# EAGLE design mast_panel_board (EAGLE 9.5.0)
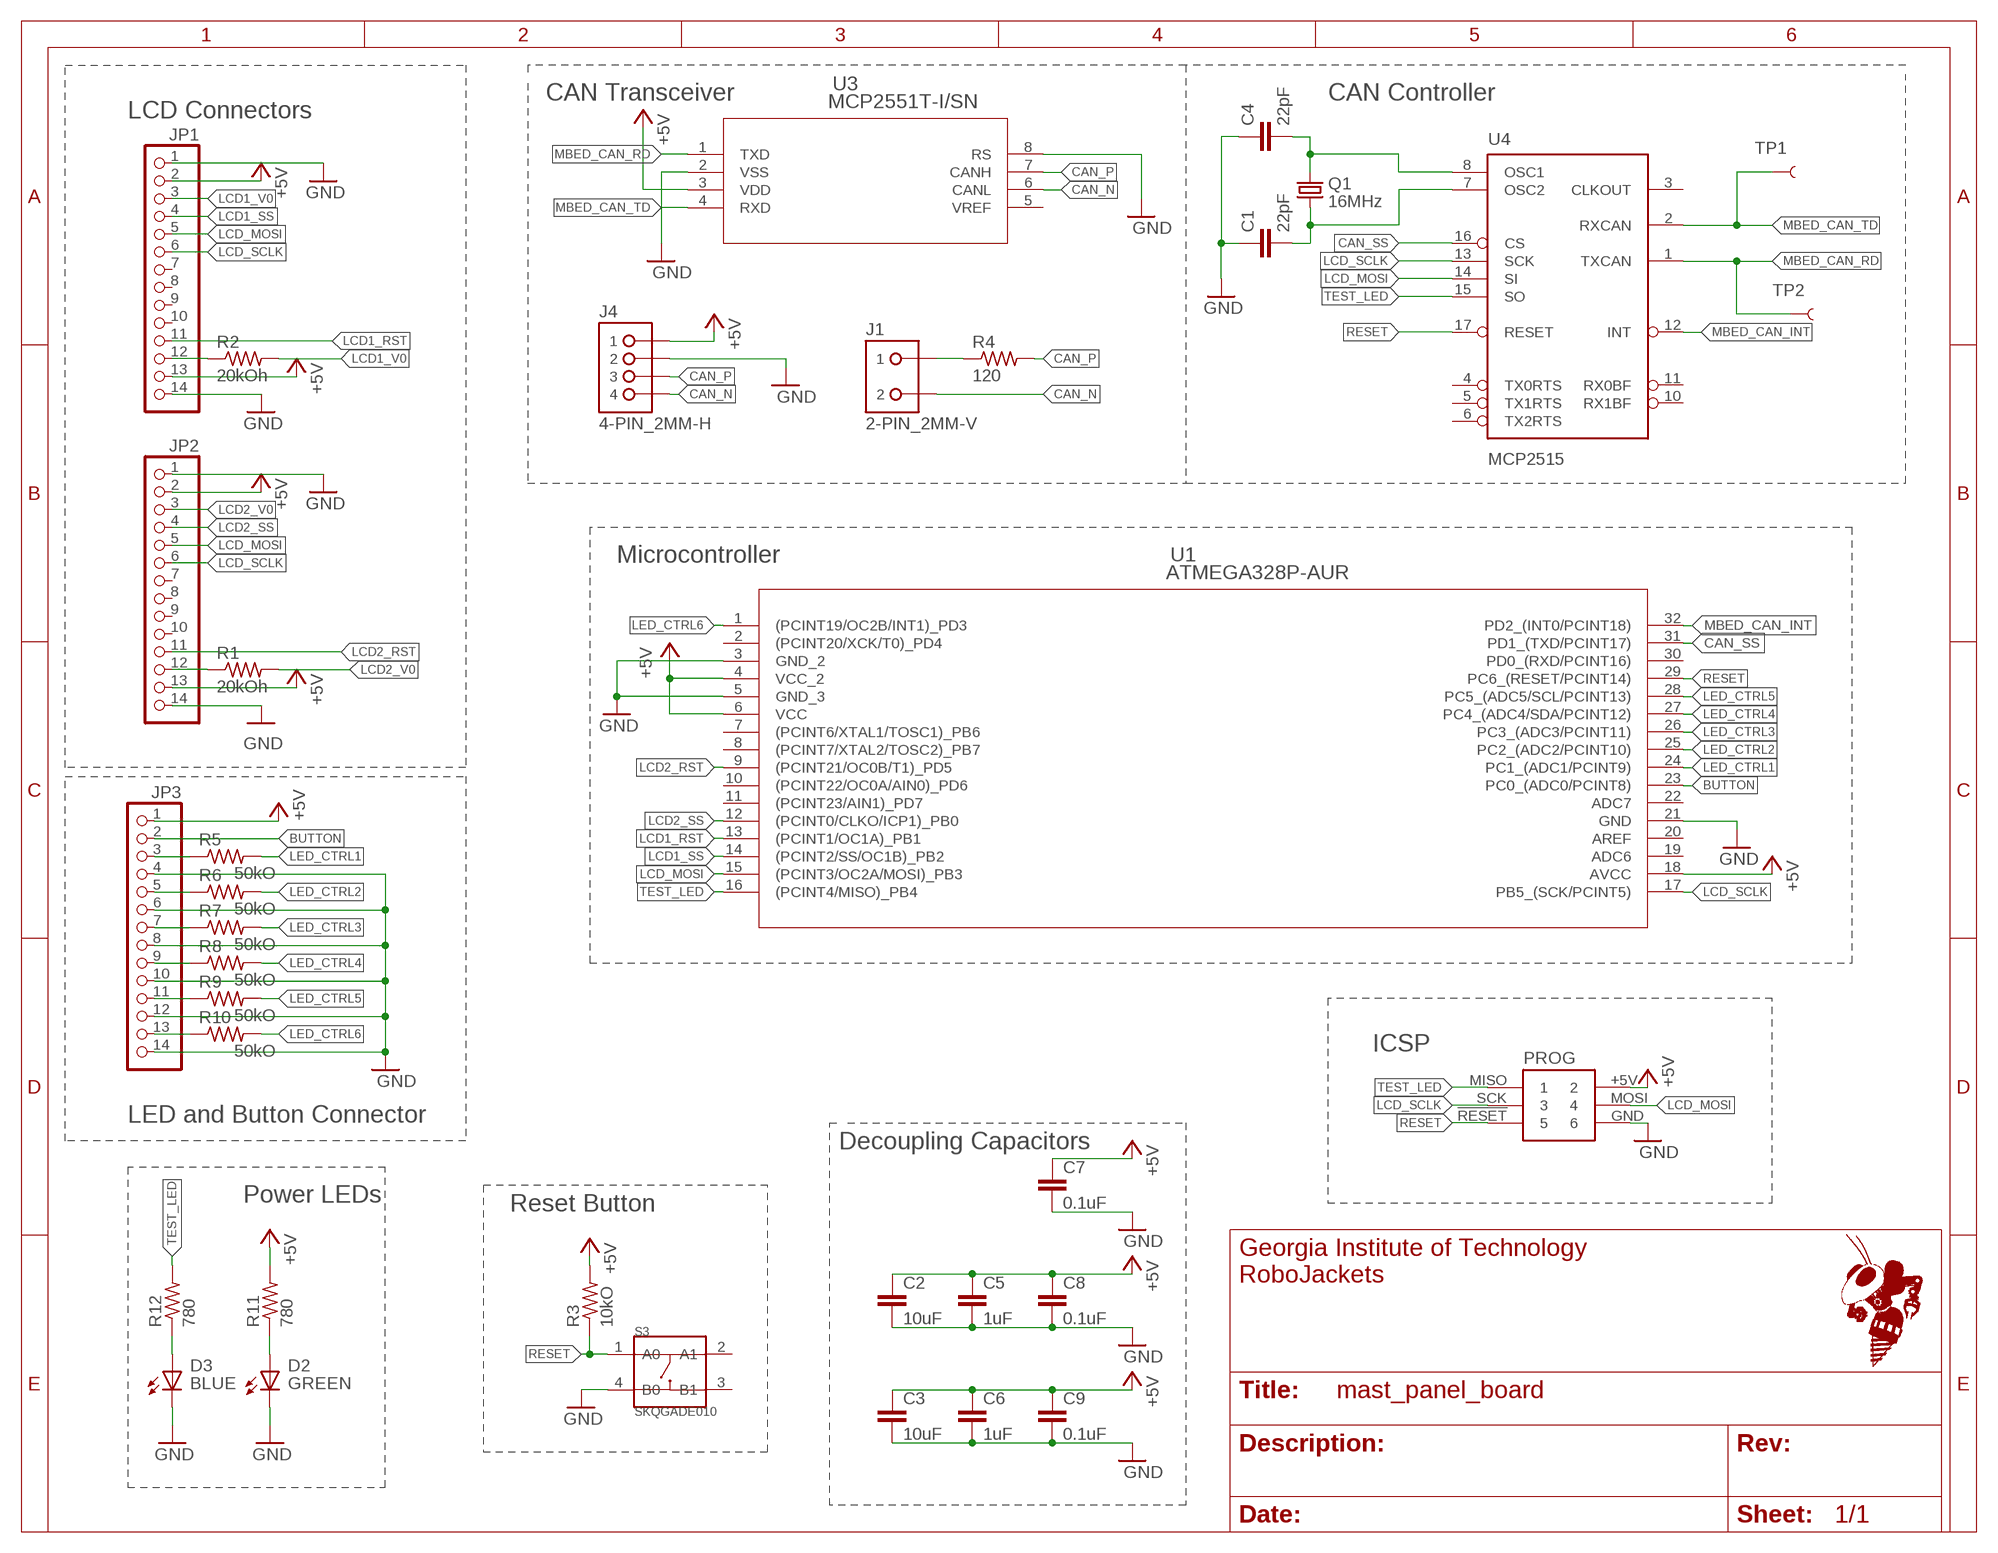
[diagram p0: schematic, sheet 1]

## Parts
C1  22pF  22PF-50V-5%(0603)  [0603-CAP]
C2  10uF  C-EUC0805  [C0805]
C3  10uF  C-EUC0805  [C0805]
C4  22pF  22PF-50V-5%(0603)  [0603-CAP]
C5  1uF  C-EUC0603  [C0603]
C6  1uF  C-EUC0603  [C0603]
C7  0.1uF  C-EUC0402  [C0402]
C8  0.1uF  C-EUC0402  [C0402]
C9  0.1uF  C-EUC0402  [C0402]
D2  GREEN  LED-SMD-GREEN  [CHIP-LED0603]
D3  BLUE  LED-SMD-BLUE  [CHIP-LED0603]
J1  2-PIN_2MM-V  [2MM-2-V]
J4  4-PIN_2MM-H  [2MM-4-H]
JP1  PINHD-1X14  [1X14]
JP2  PINHD-1X14  [1X14]
JP3  PINHD-1X14  [1X14]
PROG  ICSP Connector  2X3SHROUDED  [2X3SHROUDED]
Q1  16MHz  CRYSTAL5X3  [CRYSTAL-SMD-5X3]
R1  20kOh  R-US_R0603  [R0603]
R2  20kOh  R-US_R0603  [R0603]
R3  10kO  R-US_R0603  [R0603]
R4  120  R-US_R0603  [R0603]
R5  50kO  R-US_R0805  [R0805]
R6  50kO  R-US_R0805  [R0805]
R7  50kO  R-US_R0805  [R0805]
R8  50kO  R-US_R0805  [R0805]
R9  50kO  R-US_R0805  [R0805]
R10  50kO  R-US_R0805  [R0805]
R11  780  R-US_R0402  [R0402]
R12  780  R-US_R0402  [R0402]
S3  SKQGADE010  SMD-SWITCH-TOP-260GF(4P-D5.2MM)  [SW4-SMD-5.2X5.2X1.5MM]
TP1  TEST-POINT3X5  [PAD.03X.05]
TP2  TEST-POINT3X5  [PAD.03X.05]
U1  ATMEGA328P-AUR  [32A]
U3  MCP2551T-I/SN  [SOIC8-N_MC]
U4  MCP2515  MCP2510SO  [SO-18W]

## Nets
+5V: C2.1 C3.1 C5.1 C6.1 C7.1 C8.1 C9.1 J4.1 JP1.2 JP1.13 JP2.2 JP2.13 JP3.1 PROG.+5V R3.2 R11.2 U1.4(VCC_2) U1.6(VCC) U1.18(AVCC) U3.3(VDD)
BUTTON: JP3.2 U1.23(PC0_(ADC0/PCINT8))
CAN_N: J1.2 J4.4 U3.6(CANL)
CAN_P: J4.3 R4.2 U3.7(CANH)
CAN_SS: U1.31(PD1_(TXD/PCINT17)) U4.16(CS)
GND: C1.1 C2.2 C3.2 C4.1 C5.2 C6.2 C7.2 C8.2 C9.2 D2.C(K) D3.C(K) J4.2 JP1.1 JP1.14 JP2.1 JP2.14 JP3.4 JP3.6 JP3.8 JP3.10 JP3.12 JP3.14 PROG.GND S3.4(B0) U1.3(GND_2) U1.5(GND_3) U1.21(GND) U3.2(VSS) U3.8(RS)
LCD1_RST: JP1.11 U1.13((PCINT1/OC1A)_PB1)
LCD1_SS: JP1.4 U1.14((PCINT2/SS/OC1B)_PB2)
LCD1_V0: JP1.3 R2.2
LCD2_RST: JP2.11 U1.9((PCINT21/OC0B/T1)_PD5)
LCD2_SS: JP2.4 U1.12((PCINT0/CLKO/ICP1)_PB0)
LCD2_V0: JP2.3 R1.2
LCD_MOSI: JP1.5 JP2.5 PROG.MOSI U1.15((PCINT3/OC2A/MOSI)_PB3) U4.14(SI)
LCD_SCLK: JP1.6 JP2.6 PROG.SCK U1.17(PB5_(SCK/PCINT5)) U4.13(SCK)
LED1: JP3.3 R5.1
LED2: JP3.5 R6.1
LED3: JP3.7 R7.1
LED4: JP3.9 R8.1
LED5: JP3.11 R9.1
LED6: JP3.13 R10.1
LED_CTRL1: R5.2 U1.24(PC1_(ADC1/PCINT9))
LED_CTRL2: R6.2 U1.25(PC2_(ADC2/PCINT10))
LED_CTRL3: R7.2 U1.26(PC3_(ADC3/PCINT11))
LED_CTRL4: R8.2 U1.27(PC4_(ADC4/SDA/PCINT12))
LED_CTRL5: R9.2 U1.28(PC5_(ADC5/SCL/PCINT13))
LED_CTRL6: R10.2 U1.1((PCINT19/OC2B/INT1)_PD3)
MBED_CAN_INT: U1.32(PD2_(INT0/PCINT18)) U4.12(INT)
MBED_CAN_RD: TP2.P$1 U3.1(TXD) U4.1(TXCAN)
MBED_CAN_TD: TP1.P$1 U3.4(RXD) U4.2(RXCAN)
N$1: J1.1 R4.1
N$4: JP1.12 R2.1
N$6: D2.A R11.1
N$7: D3.A R12.1
N$9: JP2.12 R1.1
N$17: C4.2 Q1.3 U4.8(OSC1)
N$18: C1.2 Q1.1 U4.7(OSC2)
RESET: PROG.!RESET R3.1 S3.1(A0) U1.29(PC6_(RESET/PCINT14)) U4.17(RESET)
TEST_LED: PROG.MISO R12.2 U1.16((PCINT4/MISO)_PB4) U4.15(SO)
Unconnected: JP1.7 JP1.8 JP1.9 JP1.10 JP2.7 JP2.8 JP2.9 JP2.10 S3.2(A1) S3.3(B1) U1.2((PCINT20/XCK/T0)_PD4) U1.7((PCINT6/XTAL1/TOSC1)_PB6) U1.8((PCINT7/XTAL2/TOSC2)_PB7) U1.10((PCINT22/OC0A/AIN0)_PD6) U1.11((PCINT23/AIN1)_PD7) U1.19(ADC6) U1.20(AREF) U1.22(ADC7) U1.30(PD0_(RXD/PCINT16)) U3.5(VREF) U4.3(CLKOUT) U4.4(TX0RTS) U4.5(TX1RTS) U4.6(TX2RTS) U4.10(RX1BF) U4.11(RX0BF)

## Notes on the sheet
- CAN Transceiver | CAN Controller
- LCD Connectors
- Microcontroller
- ICSP
- LED and Button Connector
- Decoupling Capacitors
- Power LEDs
- Reset Button

## Power pins joined to a net without a drawn wire
VDD: U4.18(VDD)
VSS: U4.9(VSS)

## Library data of the parts
C1 C4 = SparkFun-Capacitors:22PF-50V-5%(0603): CAP-07876; PROD_ID: CAP-07876
C2 C3 C5-C9 = rcl:C-EU: CAPACITOR, European symbol; SPICEPREFIX: C
D2 = RoboJackets-LEDs:LED-SMD; DIGIKEY: 160-1446-1-ND; MPN: LTST-C191KGKT
D3 = RoboJackets-LEDs:LED-SMD; DIGIKEY: 160-1647-1-ND; MPN: LTST-C191TBKT
J1 = RoboJackets-Connectors:2-PIN_2MM-*; PINS: 2; PIN_PITCH: 2.0 mm
J4 = RoboJackets-Connectors:4-PIN_2MM-*: MPN: 0353630460; DIGIKEY: WM18933-ND; MPN: 0353630460
JP1-JP3 = pinhead:PINHD-1X14: PIN HEADER
PROG = lcd-buzzer:2X3SHROUDED
Q1 = SparkFun-FreqCtrl:CRYSTAL: Various standard crystals. Proven footprints.; PROD_ID: XTAL-08218
R1-R12 = rcl:R-US_: RESISTOR, American symbol; SPICEPREFIX: R
S3 = rgb-led:SMD-SWITCH-TOP-260GF(4P-D5.2MM): 311020017; MPN: SKQGADE010
TP1 TP2 = SparkFun-Passives:TEST-POINT: Bare copper test points for troubleshooting or ICT
U1 = MastPanel:ATMEGA328P-AUR: 32-Pin ATmega328P-AUR http://ww1.microchip.com/downloads/en/DeviceDoc/ATmega48A-PA-88A-PA-168A-PA-328-P-DS-DS40002061A.pdf; BUILT_BY: EMA_UL_Team; MANUFACTURER_PART_NUMBER: ATMEGA328P-AUR; VENDOR: Atmel
U3 = MCP2551T:MCP2551T-I/SN; MANUFACTURER_PART_NUMBER: MCP2551TISN; VENDOR: Microchip
U4 = SparkFun-DigitalIC:MCP2510: CAN controller with SPI interface to any MCU. Original design by Microchip.; PROD_ID: IC-09906

## Board
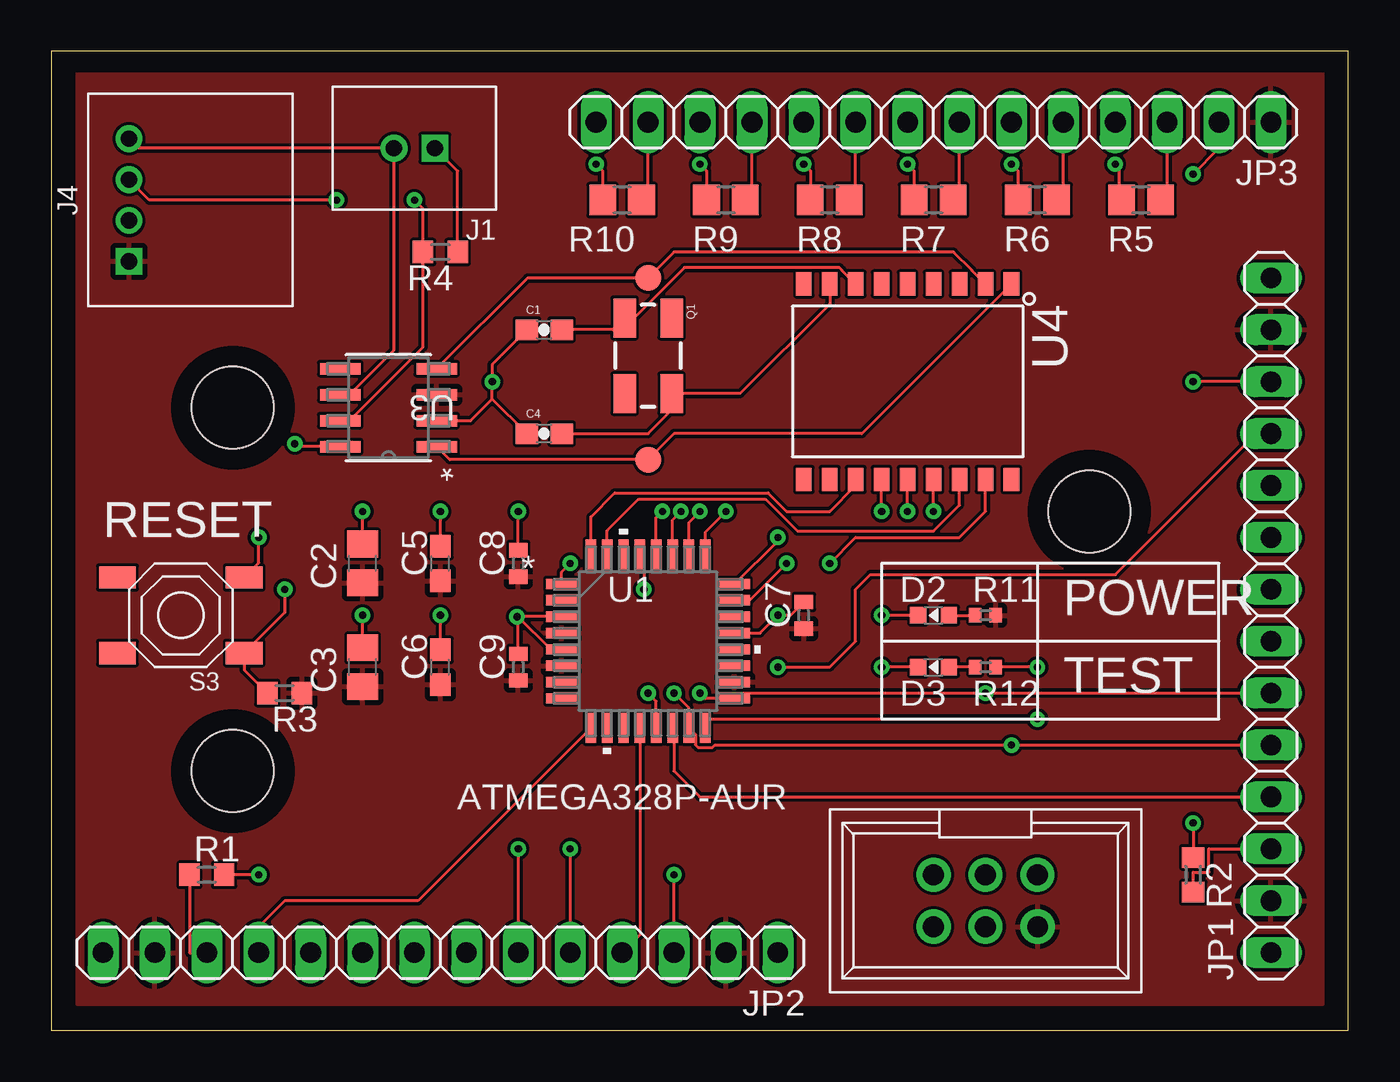
[diagram p1: board, top side]
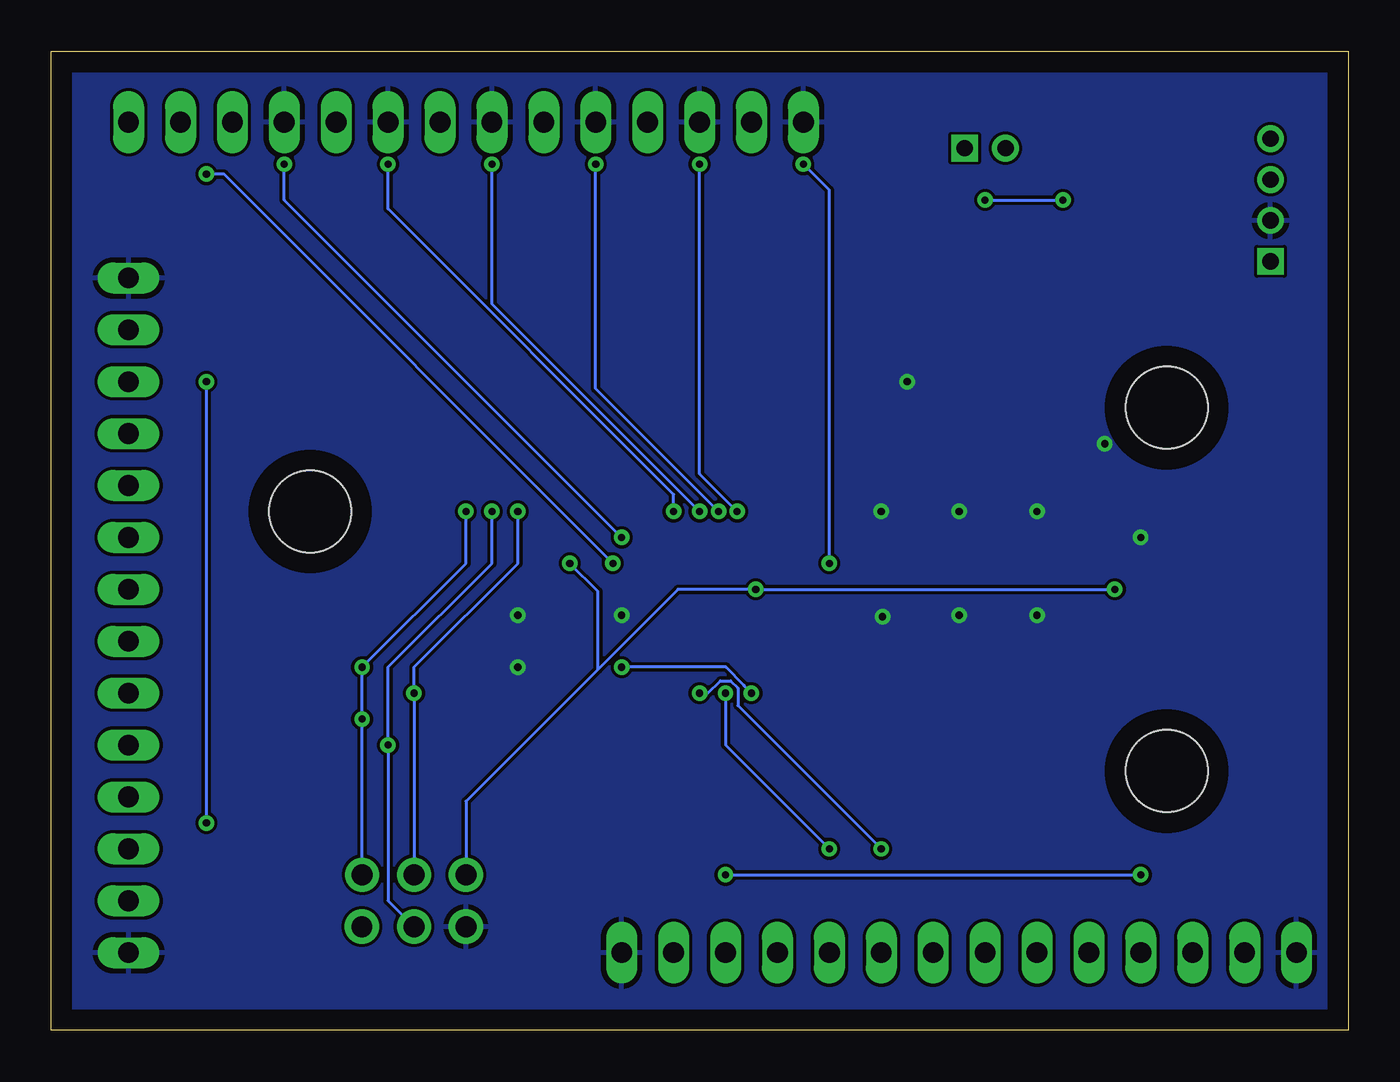
[diagram p2: board, bottom side, seen from below]

Size 63.48 x 47.93 mm. Coordinates in mm from the lower left corner, seen from the top.
Outline: 0,0 63.48,0 63.48,47.93 0,47.93 0,0
Copper layers (1*16): Top 0.035mm / dielectric 1.5mm / Bottom 0.035mm
Design rules "default": minimum track width 6mil, minimum drill 0.35mm, track to track 6mil, track to pad 6mil, pad to pad 6mil, via to via 6mil, smd to smd 6mil, copper to edge 40mil, drill to drill 6mil, minimum pad ring 10mil, minimum via ring 8mil, stop-mask expansion 4mil, vias tented up to drill 0mil, thermal gap 10mil
Holes 4 mm at 8.89,30.48 8.89,12.7 50.8,25.4

### Footprints (pad centres in the part's own frame; a part is rotated, then mirrored left to right if it is on the bottom)
0603-CAP = smd 1.1 x 1: 1 -0.85,0; 2 0.85,0
C0805 = smd 1.3 x 1.5: 1 -0.95,0; 2 0.95,0
C0603 = smd 1.1 x 1: 1 -0.85,0; 2 0.85,0
C0402 = smd 0.7 x 0.9: 1 -0.65,0; 2 0.65,0
CHIP-LED0603 = smd 0.8 x 0.8: A 0,-0.75; C 0,0.75
2MM-2-V = drill 0.8 square: 1 -1,0 | drill 0.8: 2 1,0
2MM-4-H = drill 0.8 square: 1 -3,0 | drill 0.8: 2 -1,0; 3 1,0; 4 3,0
1X14 = drill 1.016 long: 1 -16.51,0; 2 -13.97,0; 3 -11.43,0; 4 -8.89,0; 5 -6.35,0; 6 -3.81,0; 7 -1.27,0; 8 1.27,0; 9 3.81,0; 10 6.35,0; 11 8.89,0; 12 11.43,0; 13 13.97,0; 14 16.51,0
2X3SHROUDED = drill 1.02 pad 1.676: !RESET -2.54,1.27; +5V 2.554,-1.27; GND -2.54,-1.27; MISO 2.54,1.27; MOSI 0,-1.27; SCK 0,1.27
CRYSTAL-SMD-5X3 = smd 1.9 x 1.1: 1 -1.85,-1.15; 2 1.85,-1.15; 3 1.85,1.15; 4 -1.85,1.15
R0603 = smd 1 x 1.1: 1 -0.85,0; 2 0.85,0
R0805 = smd 1.3 x 1.5: 1 -0.95,0; 2 0.95,0
R0402 = smd 0.6 x 0.7: 1 -0.5,0; 2 0.5,0
SW4-SMD-5.2X5.2X1.5MM = smd 1.8 x 1.1: 1 -3.1,1.85; 2 3.1,1.85; 3 3.1,-1.85; 4 -3.1,-1.85
PAD.03X.05 = smd 1.27 x 1.27: P$1 0,0
32A = smd 1.473 x 0.508: 1 -4.242,2.8; 2 -4.242,2; 3 -4.242,1.2; 4 -4.242,0.4; 5 -4.242,-0.4; 6 -4.242,-1.2; 7 -4.242,-2; 8 -4.242,-2.8; 17 4.242,-2.8; 18 4.242,-2; 19 4.242,-1.2; 20 4.242,-0.4; 21 4.242,0.4; 22 4.242,1.2; 23 4.242,2; 24 4.242,2.8 | smd 0.508 x 1.473: 9 -2.8,-4.242; 10 -2,-4.242; 11 -1.2,-4.242; 12 -0.4,-4.242; 13 0.4,-4.242; 14 1.2,-4.242; 15 2,-4.242; 16 2.8,-4.242; 25 2.8,4.242; 26 2,4.242; 27 1.2,4.242; 28 0.4,4.242; 29 -0.4,4.242; 30 -1.2,4.242; 31 -2,4.242; 32 -2.8,4.242
SOIC8-N_MC = smd 1.981 x 0.559: 1 -2.362,1.905; 2 -2.362,0.635; 3 -2.362,-0.635; 4 -2.362,-1.905; 5 2.362,-1.905; 6 2.362,-0.635; 7 2.362,0.635; 8 2.362,1.905
SO-18W = smd 0.762 x 1.143: 1 -5.08,-4.788; 2 -3.81,-4.788; 3 -2.54,-4.788; 4 -1.27,-4.788; 5 0,-4.788; 6 1.27,-4.788; 7 2.54,-4.788; 8 3.81,-4.788; 9 5.08,-4.788; 10 5.08,4.788; 11 3.81,4.788; 12 2.54,4.788; 13 1.27,4.788; 14 0,4.788; 15 -1.27,4.788; 16 -2.54,4.788; 17 -3.81,4.788; 18 -5.08,4.788

### Placement (x,y rotation side)
C1  24.13,34.29 0 top
C2  15.24,22.86 90 top
C3  15.24,17.78 90 top
C4  24.13,29.21 0 top
C5  19.05,22.86 90 top
C6  19.05,17.78 90 top
C7  36.83,20.32 90 top
C8  22.86,22.86 90 top
C9  22.86,17.78 90 top
D2  43.18,20.32 90 top
D3  43.18,17.78 90 top
J1  17.78,43.18 180 top
J4  3.81,40.64 90 top
JP1  59.69,20.32 90 top
JP2  19.05,3.81 180 top
JP3  43.18,44.45 180 top
PROG  45.72,6.35 0 top
Q1  29.21,33.02 270 top
R1  7.62,7.62 0 top
R2  55.88,7.62 270 top
R3  11.43,16.51 0 top
R4  19.05,38.1 180 top
R5  53.34,40.64 180 top
R6  48.26,40.64 180 top
R7  43.18,40.64 180 top
R8  38.1,40.64 180 top
R9  33.02,40.64 180 top
R10  27.94,40.64 180 top
R11  45.72,20.32 0 top
R12  45.72,17.78 0 top
S3  6.35,20.32 180 top
TP1  29.21,36.83 0 top
TP2  29.21,27.94 0 top
U1  29.21,19.05 0 top
U3  16.51,30.48 180 top
U4  41.91,31.75 180 top

### Tracks (layer width: path | path; a pad name or v marks a point on that pad's centre or on a via)
+5V
  pour Top: 1.27,46.99 62.23,46.99 62.23,1.27 1.27,1.27
BUTTON  (via drill 0.35)
  Top 0.152: v55.88,41.91 57.15,43.18 JP3.2 | U1.23 34.18,21.05 v35.99,22.86
  Bottom 0.152: v35.99,22.86 36.22,23.09 36.22,23.11 55.02,41.91 v55.88,41.91
CAN_N
  Top 0.152: U3.6 14.61,31.12 16.78,33.29 J1.2 4.27,43.18 J4.4
CAN_P  (via drill 0.35)
  Top 0.152: v13.97,40.64 4.81,40.64 J4.3 | U3.7 14.61,29.84 18.2,33.44 R4.2 18.2,40.22 v17.78,40.64
  Bottom 0.152: v17.78,40.64 v13.97,40.64
CAN_SS
  Top 0.152: U4.16 44.45,25.7 43.18,24.44 36.52,24.44 34.95,26.01 28.75,26.01 27.21,24.47 U1.31
GND  (via drill 0.35)
  Top 0.152: C3.2 v15.24,20.32 | C2.2 v15.24,25.4 | C8.2 v22.86,25.4 | C6.2 v19.05,20.32 | C9.2 22.86,20.19 v22.79,20.25 v22.8,20.25 22.86,20.25 | U1.21 34.69,19.45 v35.56,20.32 36.18,20.32 C7.2 | D2.C v40.64,20.32 | D3.C v40.64,17.78 | S3.4 10.16,22.88 v10.16,24.13 | C1.1 21.59,32.6 v21.59,31.75 21.59,30.9 | U1.5 24.45,18.65 22.86,20.24 22.86,20.25 | U1.3 22.86,20.25 | C5.2 v19.05,25.4 | U3.8 12.06,28.58 v11.92,28.72 | C4.1 21.59,30.9 | U3.2 20.54,29.84 21.59,30.9
  pour Bottom: 0,46.99 63.5,46.99 63.5,0 0,0
LCD1_RST  (via drill 0.35)
  Top 0.152: U1.13 29.61,16.11 v29.21,16.51 | v35.56,17.78 38.1,17.78 39.37,19.05 39.37,21.59 40.09,22.31 52.08,22.31 58.98,29.21 JP1.11
  Bottom 0.152: v29.21,16.51 29.57,16.87 29.57,16.89 30.46,17.78 v35.56,17.78
LCD1_SS
  Top 0.152: U1.14 30.48,14.74 30.48,12.7 31.75,11.43 JP1.4
LCD1_V0
  Top 0.152: R2.2 55.88,7.74 56.66,7.74 56.66,8.89 JP1.3
LCD2_RST
  Top 0.152: U1.9 17.95,6.35 11.43,6.35 10.16,5.08 JP2.11
LCD2_SS
  Top 0.152: U1.12 28.81,4.68 JP2.4
LCD2_V0  (via drill 0.35)
  Top 0.152: JP2.3 v30.48,7.62 | v10.16,7.62 R1.2
  Bottom 0.152: v30.48,7.62 v10.16,7.62
LCD_MOSI  (via drill 0.35)
  Top 0.152: v30.48,16.51 31.21,15.78 U1.15 31.53,14.49 31.53,13.98 31.66,13.84 32.36,13.84 32.49,13.97 v46.99,13.97 JP1.5 | v25.4,8.89 JP2.5 | v41.91,25.4 U4.14
  Bottom 0.152: PROG.MOSI 46.99,6.35 v46.99,13.97 46.99,17.78 41.91,22.86 v41.91,25.4 | v30.48,16.51 30.48,13.97 v25.4,8.89
LCD_SCLK  (via drill 0.35)
  Top 0.152: v31.75,16.51 32.01,16.25 U1.17 33.71,16.51 v45.72,16.51 JP1.6 | v22.86,8.89 JP2.6 | v40.64,25.4 U4.13
  Bottom 0.152: v22.86,8.89 29.87,15.9 29.87,16.76 30.23,17.12 30.73,17.12 31.34,16.51 v31.75,16.51 | v40.64,25.4 40.64,22.86 45.72,17.78 v45.72,16.51 PROG.SCK
LED1
  Top 0.152: R5.1 54.61,40.96 JP3.3
LED2
  Top 0.152: R6.1 49.53,40.96 JP3.5
LED3
  Top 0.152: R7.1 44.45,40.96 JP3.7
LED4
  Top 0.152: R8.1 39.37,40.96 JP3.9
LED5
  Top 0.152: R9.1 34.29,40.96 JP3.11
LED6
  Top 0.152: R10.1 29.21,40.96 JP3.13
LED_CTRL1  (via drill 0.35)
  Top 0.152: R5.2 52.24,40.64 52.24,42.22 v52.07,42.4 | U1.24 35.56,23.96 v35.56,24.13
  Bottom 0.152: v35.56,24.13 52.07,40.64 v52.07,42.4
LED_CTRL2  (via drill 0.35)
  Top 0.152: U1.25 32.01,24.39 v33.02,25.4 | v46.99,42.4 47.31,42.08 R6.2
  Bottom 0.152: v33.02,25.4 33.02,26.24 46.99,40.21 v46.99,42.4
LED_CTRL3  (via drill 0.35)
  Top 0.152: U1.26 31.21,24.86 v31.75,25.4 | v41.91,42.4 42.23,42.08 R7.2
  Bottom 0.152: v31.75,25.4 41.91,35.56 v41.91,42.4
LED_CTRL4  (via drill 0.35)
  Top 0.152: U1.27 30.41,24.99 v30.82,25.4 | v36.83,42.4 37.15,42.08 R8.2
  Bottom 0.152: v30.82,25.4 36.83,31.41 v36.83,42.4
LED_CTRL5  (via drill 0.35)
  Top 0.152: U1.28 29.61,25.1 v29.91,25.4 | v31.75,42.4 32.07,42.08 R9.2
  Bottom 0.152: v29.91,25.4 31.75,27.24 v31.75,42.4
LED_CTRL6  (via drill 0.35)
  Top 0.152: U1.1 24.97,22.43 v25.4,22.86 | v26.67,42.4 26.99,42.08 R10.2
  Bottom 0.152: v26.67,42.4 25.4,41.12 v25.4,22.86
MBED_CAN_INT
  Top 0.152: U4.12 39.37,26.67 38.1,25.4 35.99,25.4 35.08,26.31 27.58,26.31 26.41,25.14 U1.32
MBED_CAN_RD
  Top 0.152: U3.1 19.51,27.94 TP2.P$1 30.48,29.21 39.67,29.21 46.33,35.87 46.33,35.88 U4.1
MBED_CAN_TD
  Top 0.152: U4.2 45.06,37.2 44.16,38.1 30.48,38.1 TP1.P$1 23.32,36.83 U3.4
N$1
  Top 0.152: R4.1 19.9,42.06 J1.1
N$4  (via drill 0.35)
  Top 0.152: JP1.12 v55.88,31.75 | v55.88,10.16 R2.1
  Bottom 0.152: v55.88,31.75 v55.88,10.16
N$6
  Top 0.152: D2.A R11.1
N$7
  Top 0.152: R12.1 D3.A
N$9
  Top 0.152: R1.1 6.77,3.81 JP2.12
N$17
  Top 0.152: C4.2 29.21,29.21 30.36,30.36 Q1.3 33.71,31.17 38.1,35.56 U4.8
N$18
  Top 0.152: Q1.1 27.71,34.52 | 27.71,34.52 27.48,34.29 C1.2 | U4.7 38.71,37.2 38.58,37.34 30.99,37.34 28.17,34.52 27.71,34.52
RESET  (via drill 0.35)
  Top 0.152: U1.29 29,23.1 v29,21.59 | R3.1 9.45,17.64 S3.1 11.43,20.45 v11.43,21.59 | v38.1,22.86 39.37,24.13 44.45,24.13 45.72,25.4 U4.17
  Bottom 0.152: v11.43,21.59 v29,21.59 32.81,21.59 36.73,17.68 | PROG.!RESET 43.18,11.22 36.73,17.68 | 36.73,17.68 36.73,21.49 v38.1,22.86
TEST_LED  (via drill 0.35)
  Top 0.152: U1.16 32.01,15.24 v48.26,15.24 | v48.26,17.78 R12.2 | v43.18,25.4 U4.15
  Bottom 0.152: PROG.MISO v48.26,15.24 v48.26,17.78 43.18,22.86 v43.18,25.4

### Text on the board
tPlace: RESET | POWER | TEST